# Altium schematic sheet Sheet1.SchDoc
size A4
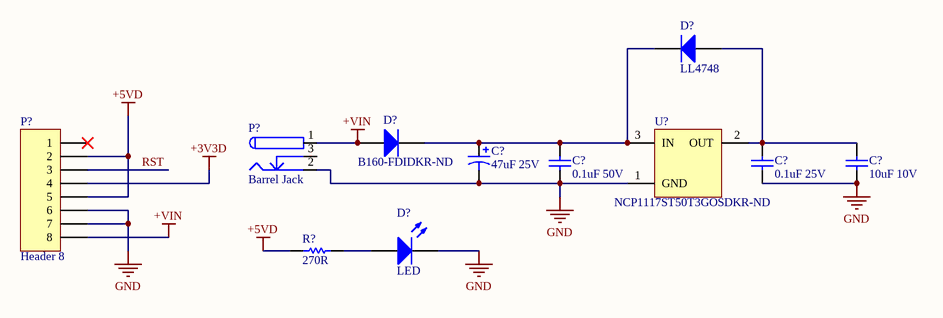
[diagram p0: Sheet1.SchDoc]

## Parts
(Parts that share a designator on the sheet are numbered #1, #2 ... from top to bottom, then left to right.)
C?#1  47uF 25V  [Cap_Al_SMD_C6_6.6x6.6mm]
C?#2  0.1uF 50V  [C0603[0201]]
C?#3  0.1uF 25V  [C0603[0201]]
C?#4  10uF 10V  [C2012[0805]]
D?#1  LL4748  [SOD-80/MLL34]
D?#2  Supplier Part Number 1: B160-FDIDKR-ND  [DO214AC]  (hidden comment: B160-13-F)
D?#3  LED  [LED-0603-G]
P?#1  Header 8  [HDR1X8F]
P?#2  Barrel Jack  [BARREL2.5]
R?  270R  [R1608[0603]]
U?  Supplier Part Number 1: NCP1117ST50T3GOSDKR-ND  [SOT223_N]  (hidden comment: NCP1117ST50T3G)

## Nets
+3V3D: P?#1.4
+5VD: P?#1.2 P?#1.5 R?.1
+VIN: D?#2.1(A) P?#1.8 P?#2.1
GND: C?#1.2 C?#2.1 C?#3.1 C?#4.1 D?#3.2(K) P?#1.6 P?#1.7 P?#2.2 U?.1(GND)
RST: P?#1.3
NetC?#1_1: C?#1.1 C?#2.2 D?#1.2(K) D?#2.2(K) U?.3(IN)
NetC?#3_2: C?#3.2 C?#4.2 D?#1.1(A) U?.2(OUT)
NetD?#3_1: D?#3.1(A) R?.2

Not connected (* = marked no-connect by the designer): P?#1 1*; P?#2 3

## Library data of the parts
C?#1 = CP: Polarized Capacitor; Manufacturer Part Number: EEE-HA1E470WP; Tolerance: 20%; Ripple Current: 70mA; Life (Hours): 1000Hour; Leakage Current: 11.7uA; Lead Diameter: 0.65mm; Manufacturer: *; PartNumber: *; Package Type: *; Value: *; Supplier 1: Digi-Key; Supplier Part Number 1: PCE4206DKR-ND; Stock 1: 156126; Pricing 1: 1=0.43, 10=0.301, 100=0.1808, 500=0.13558 (USD); Mount: PCB,Surface Mount; Case/Package: Radial; Contact Plating: Tin; Min Operating Temperature: -40°C; Max Operating Temperature: 105°C; Capacitance: 47uF; Ripple Current (AC): 70mA; Voltage Rating: 25V; Packaging: Tape and Reel; Package Quantity: 1; Voltage Rating (DC): 25V; Termination: SMD/SMT; Voltage: 25V; Diameter: 6.3mm; Length: 5.5mm; Height: 5.4mm; Lead Pitch: 1.8mm; Height - Seated (Max): 0.213inch; Width: 650um; Radiation Hardening: No; REACH SVHC: Unknown; Lead Free: Lead Free; ComponentLink1URL: http://uk.rs-online.com/webdocs/102e/0900766b8102e3f9.pdf; ComponentLink1Description: http://uk.rs-online.com/webdocs/102e/0900766b8102e3f9.pdf; ComponentLink2URL: http://industrial.panasonic.com/www-data/pdf/ABA0000/ABA0000CE3.pdf; ComponentLink2Description: http://industrial.panasonic.com/www-data/pdf/ABA0000/ABA0000CE3.pdf; ComponentLink3URL: http://www.farnell.com/datasheets/1446029.pdf; ComponentLink3Description: http://www.farnell.com/datasheets/1446029.pdf; ComponentLink4URL: http://www.farnell.com/datasheets/2059663.pdf; ComponentLink4Description: http://www.farnell.com/datasheets/2059663.pdf; ComponentLink5URL: https://www.alliedelec.com/m/d/7ecf71cebe655f70ab90926cc286bede.pdf; ComponentLink5Description: https://www.alliedelec.com/m/d/7ecf71cebe655f70ab90926cc286bede.pdf; ComponentLink6URL: http://www.jameco.com/Jameco/Products/ProdDS/1984291.pdf; ComponentLink6Description: http://www.jameco.com/Jameco/Products/ProdDS/1984291.pdf
C?#2 = C: Capacitor; Manufacturer Part Number: C1608X7R1H104M080AA; Value: 1; Dielectric Material: Ceramic; Capacitance: 100nF; Tolerance: 20%; Dielectric: X7R; Manufacturer: *; PartNumber: *; Package Type: *; Supplier 1: Digi-Key; Supplier Part Number 1: 445-5098-6-ND; Stock 1: 0; Pricing 1: 1=0.1, 10=0.074, 100=0.0331, 500=0.02366, 1000=0.0186 (USD); Mount: Surface Mount; Case/Package: 0603; Number of Pins: 2; Weight: 7.1E-05oz; Case Code (Metric): 1608; Case Code (Imperial): 0603; Min Operating Temperature: -55°C; Max Operating Temperature: 125°C; Package Quantity: 1; Voltage Rating: 50V; Packaging: Tape and Reel; Voltage Rating (DC): 50V; Termination: SMD/SMT; Composition: Ceramic; Length: 1.6mm; Height: 0.8mm; Width: 0.031inch; Depth: 0.8mm; Thickness: 0.037inch; Radiation Hardening: No; REACH SVHC: No SVHC; Lead Free: Lead Free; ComponentLink1URL: http://www.farnell.com/datasheets/1571323.pdf; ComponentLink1Description: http://www.farnell.com/datasheets/1571323.pdf; ComponentLink2URL: https://product.tdk.com/info/en/catalog/spec/mlccspec_commercial_general_midvoltage_en.pdf; ComponentLink2Description: https://product.tdk.com/info/en/catalog/spec/mlccspec_commercial_general_midvoltage_en.pdf; ComponentLink3URL: http://www.tdk.co.jp/tefe02/e412_c.pdf; ComponentLink3Description: http://www.tdk.co.jp/tefe02/e412_c.pdf
C?#3 C?#4 = C: Capacitor; Value: 1; Manufacturer: *; PartNumber: *; Package Type: *
D?#1 = D: Diode; Manufacturer: *; PartNumber: *; Package Type: *
D?#2 = D: Diode; Peak Reverse Current: 500uA; Forward Current: 1A; Max Repetitive Reverse Voltage (Vrrm): 60V; Peak Non-Repetitive Surge Current: 30A; Element Configuration: Single; Forward Voltage: 700mV; Polarity: Standard; Capacitance: 110pF; Manufacturer: *; PartNumber: *; Package Type: *; Supplier 1: Digi-Key; Manufacturer Part Number: B160-13-F; Stock 1: 242650; Pricing 1: 1=0.37, 10=0.304, 100=0.1615, 500=0.10622, 1000=0.07223 (USD); Mount: Surface Mount; Case/Package: SMA; Number of Pins: 2; Weight: 0.002258oz; Contact Plating: Matte,Tin; Min Operating Temperature: -65°C; Max Operating Temperature: 150°C; Package Quantity: 5000; Packaging: Tape and Reel; Average Rectified Current: 1A; Max Forward Surge Current (Ifsm): 30A; Termination: SMD/SMT; Voltage Rating (DC): 60V; Current Rating: 1A; Output Current: 1A; Max Reverse Voltage (DC): 60V; Length: 4.6mm; Height: 2.1mm; Width: 2.92mm; Radiation Hardening: No; REACH SVHC: No SVHC; Lead Free: Lead Free; ComponentLink1URL: https://www.diodes.com/assets/Datasheets/ds13002.pdf; ComponentLink1Description: https://www.diodes.com/assets/Datasheets/ds13002.pdf; ComponentLink2URL: http://www.farnell.com/datasheets/1911815.pdf; ComponentLink2Description: http://www.farnell.com/datasheets/1911815.pdf; ComponentLink3URL: http://www.diodes.com/datasheets/ds13002.pdf; ComponentLink3Description: http://www.diodes.com/datasheets/ds13002.pdf; ComponentLink4URL: http://www.diodes.com///datasheets/ds13002.pdf; ComponentLink4Description: http://www.diodes.com///datasheets/ds13002.pdf
P?#1 = Header 8: Header, 8-Pin; LatestRevisionDate: 17-Jul-2002; LatestRevisionNote: Re-released for DXP Platform.; Publisher: Altium Limited
P?#2 = PWR2.5: Low Voltage Power Supply Connector; Manufacturer: Memory Protection Devices; Manufacturer Part Number: EJ503A; Pricing 1: 1=2.7, 10=2.447, 100=2.0977, 500=1.74806, 1000=1.49834 (USD); Stock 1: 1084; Supplier 1: Digi-Key; Supplier Part Number 1: EJ503A-ND
R? = R: Resistor; Value: 0; Manufacturer: *; PartNumber: *; Package Type: *
U? = Regulator: Output Voltage: 5V; Number of Outputs: 1; Max Input Voltage: 20V; Output Current: 1A; Min Input Voltage: 3.5V; Dropout Voltage: 1.2V; Input Bias Current: 6mA; Polarity: Positive; Quiescent Current: 10mA; Output Voltage Accuracy: 1%; Power Rating: 781mW; Output Type: Fixed; Manufacturer: *; Package Type: *; PartNumber: *; Supplier 1: Digi-Key; Manufacturer Part Number: NCP1117ST50T3G; Stock 1: 10748; Pricing 1: 1=0.54, 10=0.458, 100=0.3423, 500=0.26896, 1000=0.20783 (USD); Case/Package: SOT-223; Number of Pins: 4; Contact Plating: Matte,Tin; Min Operating Temperature: 0°C; Max Operating Temperature: 125°C; Package Quantity: 1; Max Output Current: 1A; Nominal Output Voltage: 5V; Packaging: Tape and Reel; Number of Regulators: 1; Min Current Limit: 1A; Accuracy: 1%; Tolerance: 1%; Length: 6.7mm; Height: 1.69mm; Width: 3.7mm; Radiation Hardening: No; REACH SVHC: No SVHC; Lead Free: Lead Free; Halogen Free: Halogen Free; ComponentLink1URL: http://www.onsemi.com/pub/Collateral/NCP1117-D.PDF; ComponentLink1Description: http://www.onsemi.com/pub/Collateral/NCP1117-D.PDF; ComponentLink2URL: http://www.onsemi.ru.com/pub/Collateral/NCP1117-D.PDF; ComponentLink2Description: http://www.onsemi.ru.com/pub/Collateral/NCP1117-D.PDF; ComponentLink3URL: http://www.farnell.com/datasheets/1748260.pdf; ComponentLink3Description: http://www.farnell.com/datasheets/1748260.pdf; ComponentLink4URL: http://www.onsemi.com/pub_link/Collateral/NCP1117-D.PDF; ComponentLink4Description: http://www.onsemi.com/pub_link/Collateral/NCP1117-D.PDF; ComponentLink5URL: http://www.farnell.com/datasheets/1878391.pdf; ComponentLink5Description: http://www.farnell.com/datasheets/1878391.pdf
D?#3 = LED: Manufacturer: *; PartNumber: *; Package Type: *